# EAGLE design VF_GS_PCB (EAGLE 9.6.2)
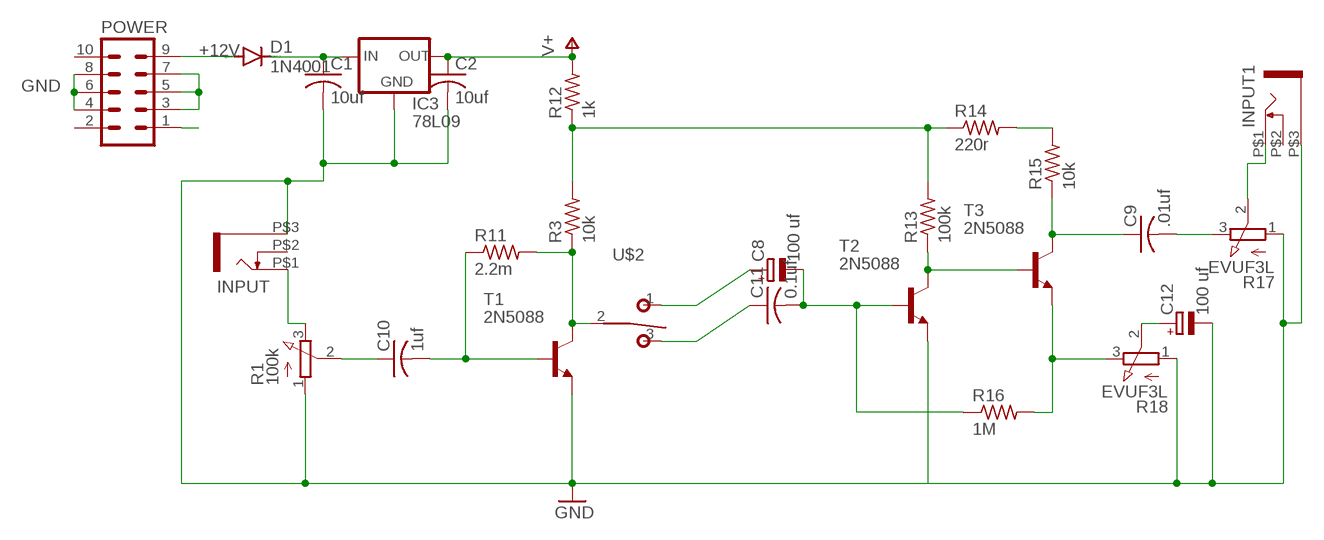
[diagram p0: schematic, sheet 1]

## Parts
C1  10uf  C-US050-025X075  [C050-025X075]
C2  10uf  C-US050-025X075  [C050-025X075]
C8  100 uf  CPOL-EUE2.5-6  [E2,5-6]
C9  .01uf  C-US050-025X075  [C050-025X075]
C10  1uf  C-US050-025X075  [C050-025X075]
C11  0.1uf  C-US050-025X075  [C050-025X075]
C12  100 uf  CPOL-EUE2.5-6  [E2,5-6]
D1  1N4001  1N4004  [DO41-10]
IC3  78L09  78LXX  [78LXX]
INPUT  WQP-PJ301M-12_JACK  [WQP-PJ301M-12_JACK]
INPUT1  WQP-PJ301M-12_JACK  [WQP-PJ301M-12_JACK]
POWER  10_PIN_HEADER  [MA05-2]
R1  100k  EVUF3L  [EVUFXL]
R3  10k  R-US_0207/7  [0207/7]
R11  2.2m  R-US_0207/7  [0207/7]
R12  1k  R-US_0207/7  [0207/7]
R13  100k  R-US_0207/7  [0207/7]
R14  220r  R-US_0207/7  [0207/7]
R15  10k  R-US_0207/7  [0207/7]
R16  1M  R-US_0207/7  [0207/7]
R17  EVUF3L  [EVUFXL]
R18  EVUF3L  [EVUFXL]
T1  2N5088  [TO92]
T2  2N5088  [TO92]
T3  2N5088  [TO92]
U$2  T-80-T-SPDT-ON-OFF-ON  [M9040P]

## Nets
+12V [power]: C1.1 D1.C IC3.IN
-12V [power]: POWER.1
GND: C1.2 C2.2 C12.- IC3.GND INPUT1.P$3 INPUT.P$3 POWER.3 POWER.4 POWER.5 POWER.6 POWER.7 POWER.8 R1.1(A) R17.1(A) R18.1(A) T1.3(E) T2.3(E)
N$1: C10.1 R1.2(S)
N$2: INPUT.P$1 R1.3(E)
N$3: INPUT1.P$1 R17.2(S)
N$4: D1.A POWER.9
N$5: C10.2 R11.1 T1.2(B)
N$14: R3.1 R11.2 T1.1(C) U$2.2(P)
N$16: R3.2 R12.1 R13.2 R14.1
N$18: C8.- C11.2 R16.1 T2.2(B)
N$20: R13.1 T2.1(C) T3.2(B)
N$22: R14.2 R15.2
N$23: C9.1 R15.1 T3.1(C)
N$24: C9.2 R17.3(E)
N$25: C12.+ R18.2(S)
N$27: C11.1 U$2.3(S)
N$28: C8.+ U$2.1(O)
N$32: R16.2 R18.3(E) T3.3(E)
V+: C2.1 IC3.OUT R12.2
Unconnected: INPUT1.P$2 INPUT.P$2 POWER.2 POWER.10

## Library data of the parts
C1 C2 C9-C11 = rcl:C-US: CAPACITOR, American symbol; SPICEPREFIX: C
C8 C12 = rcl:CPOL-EU: POLARIZED CAPACITOR, European symbol
D1 = diode:1N4004: DIODE general purpose rectifier, 1 A
IC3 = v-reg:78LXX: VOLTAGE REGULATOR
INPUT INPUT1 = thonkiconn:WQP-PJ301M-12_JACK
POWER = TomW:10_PIN_HEADER: PIN HEADER; OC_FARNELL: unknown; OC_NEWARK: unknown
R1 R17 R18 = pot:EVU: 9 mm Square Rotary Potentiometers Source: Panasonic
R3 R11-R14 = rcl:R-US_: RESISTOR, American symbol
R15 R16 = rcl:R-US_: RESISTOR, American symbol; SPICEPREFIX: R
T1-T3 = transistor:2N5088: NPN TRANSISTOR
U$2 = MusicThingModular:T-80-T-SPDT-ON-OFF-ON

## Net classes
1 power: width 0.61 mm

## Board
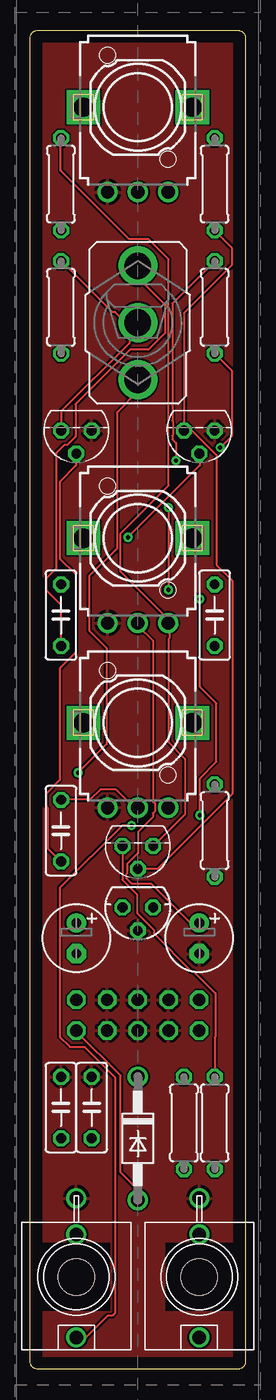
[diagram p1: board, top side]
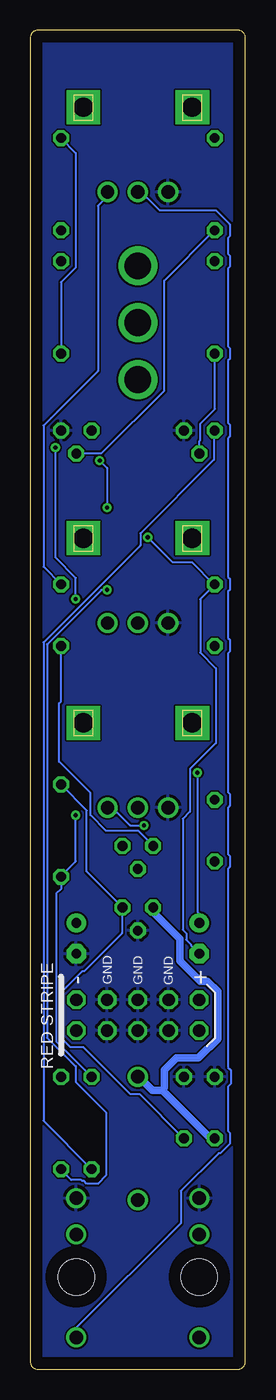
[diagram p2: board, bottom side, seen from below]

Size 17.78 x 110.49 mm. Coordinates in mm from the lower left corner, seen from the top.
Copper layers (1*16): Top 0.035mm / dielectric 1.5mm / Bottom 0.035mm
Design rules "default": minimum track width 6mil, minimum drill 0.35mm, track to track 6mil, track to pad 6mil, pad to pad 6mil, via to via 6mil, smd to smd 6mil, copper to edge 40mil, drill to drill 6mil, minimum pad ring 10mil, minimum via ring 8mil, stop-mask expansion 4mil, vias tented up to drill 0mil, thermal gap 10mil
Holes 3 mm at 3.81,7.62 13.97,7.62

### Footprints (pad centres in the part's own frame; a part is rotated, then mirrored left to right if it is on the bottom)
C050-025X075 = drill 0.813 octagon: 1 -2.54,0; 2 2.54,0
E2,5-6 = drill 0.813 pad 1.6: + -1.27,0 | drill 0.813 pad 1.6 octagon: - 1.27,0
DO41-10 = drill 1.118: A 5.08,0; C -5.08,0
78LXX = drill 0.813 octagon: GND 0,1.905; IN 1.27,0; OUT -1.27,0
WQP-PJ301M-12_JACK = drill 1.1: P$1 0,5; P$2 0,-3.5; P$3 0,-6.5
MA05-2 = drill 1.016 octagon: 1 -5.08,-1.27; 2 -5.08,1.27; 3 -2.54,-1.27; 4 -2.54,1.27; 5 0,-1.27; 6 0,1.27; 7 2.54,-1.27; 8 2.54,1.27; 9 5.08,-1.27; 10 5.08,1.27
EVUFXL = drill 1.1 pad 1.676: 1 -2.5,-7; 2 0,-7; 3 2.5,-7 | drill 1.6 pad 2.8 square: M1 4.5,0; M2 -4.5,0
0207/7 = drill 0.813 octagon: 1 -3.81,0; 2 3.81,0
TO92 = drill 0.813 octagon: 1 1.27,0; 2 0,1.905; 3 -1.27,0
M9040P = drill 2.2: 1 0,4.699 | drill 2.2 pad 3: 2 0,0; 3 0,-4.699

### Placement (x,y rotation side)
C1  2.54,21.59 90 top
C2  5.08,21.59 90 top
C8  3.81,35.56 270 top
C9  15.24,62.23 90 top
C10  2.54,44.45 270 top
C11  2.54,62.23 90 top
C12  13.97,35.56 270 top
D1  8.89,19.05 270 top
IC3  8.89,38.1 180 top
INPUT  3.81,7.62 180 top
INPUT1  13.97,7.62 180 top
POWER  8.89,29.21 0 bottom
R1  8.89,53.34 0 top
R3  12.7,20.32 90 top
R11  2.54,87.63 90 top
R12  15.24,44.45 90 top
R13  15.24,97.79 90 top
R14  15.24,87.63 90 top
R15  15.24,20.32 270 top
R16  2.54,97.79 90 top
R17  8.89,104.14 0 top
R18  8.89,68.58 0 top
T1  3.81,77.47 180 top
T2  13.97,77.47 180 top
T3  8.89,43.18 180 top
U$1  [EURO_PCB_4HP]  -1.27,-8.89 0 top  (outside the outline)
U$2  8.89,86.36 180 top

### Tracks (layer width: path | path; a pad name or v marks a point on that pad's centre or on a via)
+12V
  Bottom 0.61: C1.1 2.9,19.05 6.86,23.01 | 6.86,23.01 7.7,23.01 8.84,24.16 D1.C | IC3.IN 7.62,37.72 5.41,35.51 5.41,33.68 3.73,32 3.12,32 2.29,31.17 2.29,27.28 3.89,25.68 5.71,25.68 6.71,24.69 6.71,23.24 6.86,23.01
GND
  pour Top: -1.27,0 19.05,0 19.05,110.49 17.78,111.76 -1.27,111.76
  pour Bottom: -1.27,0 19.05,0 19.05,111.76 -1.27,111.76
N$1
  Top 0.152: C10.1 2.59,47.02 4.95,47.02 5.79,47.85 7.09,47.85 8.53,46.41 8.84,46.41 R1.2
N$2  (via drill 0.35)
  Top 0.152: v8.38,44.88 7.62,44.88 2.44,39.7 2.44,27.43 3.28,26.59 4.5,26.59 7.01,24.08 7.01,4.65 6.78,4.42 6.4,4.42 4.65,2.67 3.81,2.67 INPUT.P$1
  Bottom 0.152: v8.38,44.88 9.53,44.88 10.97,46.33 11.35,46.33 R1.3
N$3
  Bottom 0.152: INPUT1.P$1 13.97,3.4 5.33,12.04 5.33,14.71 2.21,17.83 2.06,17.83 1.29,18.59 1.29,19.51 1.45,19.66 1.45,23.32 1.22,23.55 1.22,24.69 1.45,24.92 1.45,41.3 1.29,41.45 1.29,42.37 1.45,42.52 1.45,46.33 1.29,46.48 1.29,47.47 1.45,47.62 1.45,59.05 1.29,59.21 1.29,60.2 1.45,60.35 1.45,64.16 1.29,64.31 1.29,65.23 1.45,65.38 1.45,76.81 1.29,76.96 1.29,77.95 1.45,78.11 1.45,83.21 1.29,83.36 1.29,84.28 1.45,84.43 1.45,90.83 1.29,90.98 1.29,91.9 1.45,92.05 1.45,93.34 1.29,93.5 1.29,94.49 2.44,95.63 7.09,95.63 8.53,97.08 8.84,97.08 R17.2
N$4
  Top 0.152: POWER.9 3.81,27.89 7.47,24.23 7.47,16.23 8.91,14.78 8.91,14.02 D1.A
N$5
  Top 0.152: T1.2 3.81,74.6 2.44,73.23 2.44,66.9 3.73,65.61 3.73,59.13 2.44,57.84 2.44,48.62 1.29,47.47 1.29,46.48 1.45,46.33 1.45,42.98 2.52,41.91 C10.2
  Bottom 0.152: T1.2 3.81,76.58 3.73,76.66 3.73,78.03 2.52,79.25 2.52,83.82 R11.1
N$14
  Top 0.152: 8.23,86.41 8.84,86.41 U$2.2 8.23,86.41 | 8.23,86.41 7.85,86.41 7.01,87.25 6.78,87.25 2.59,91.44 R11.2 | 8.23,86.41 8.23,84.73 2.59,79.1 2.59,77.5 T1.1
  Bottom 0.152: R3.1 16.69,20.5 16.69,59.97 8.69,67.97 8.69,68.96 2.59,75.06 2.59,77.42 T1.1
N$16  (via drill 0.35)
  Top 0.152: R14.1 16.69,82.37 16.69,77.04 v15.7,76.05 | v14.02,63.55 14.02,56.31 15.39,54.94 15.39,50.14 14.02,48.77 v14.02,45.72
  Bottom 0.152: R14.1 15.24,89.69 14.02,90.91 14.02,100.36 15.24,101.58 R13.2 | R3.2 15.62,27.05 15.62,39.24 15.24,39.62 R12.1 15.24,40.69 14.02,41.91 v14.02,45.72 | v15.7,76.05 15.7,66.98 14.02,65.3 v14.02,63.55
N$18  (via drill 0.35)
  Top 0.152: v8.08,68.66 14.02,74.6 14.02,75.51 T2.2
  Bottom 0.152: v8.08,68.66 6.02,66.6 4.42,66.6 2.59,64.77 C11.2 2.52,64.77 3.73,63.55 3.73,59.13 2.44,57.84 2.44,51.66 4.57,49.53 4.57,46.02 5.18,45.41 5.18,36.27 4.88,35.97 4.88,35.43 4.5,35.05 4.5,34.98 C8.- | R16.1 2.59,93.95 6.71,89.84 6.71,80.77 11.89,75.59 13.95,75.59 T2.2
N$20
  Top 0.152: 12.72,77.5 13.34,77.5 15.39,75.44 15.39,66.37 16.69,65.08 16.69,47.47 10.52,41.3 8.91,41.3 T3.2 | 12.72,77.5 12.72,87.17 16.69,91.14 16.69,92.51 15.24,93.95 R13.1 | 12.72,77.5 T2.1
N$22  (via drill 0.35)
  Top 0.152: v11.43,71.09 v11.43,64.31 | v12.04,74.98 12.04,76.43 11.73,76.73 11.73,77.04 11.81,77.11 11.81,78.18 11.73,78.26 11.73,87.94 R14.2
  Bottom 0.152: v11.43,64.31 11.89,64.31 16.38,59.82 16.38,27.36 14.02,24.99 14.02,23.7 11.51,21.18 11.51,16 12.19,15.32 13.11,15.32 13.34,15.54 13.49,15.54 13.56,15.62 14.4,15.62 15.24,16.46 R15.2 | v11.43,71.09 11.43,74.37 v12.04,74.98
N$23
  Top 0.152: R15.1 15.24,27.36 15.32,27.43 15.32,31.01 13.49,32.84 13.34,32.84 10.21,35.97 10.21,36.27 8.84,37.64 8.84,39.17 7.62,40.39 T3.1
  Bottom 0.152: C9.1 15.24,55.09 15.39,54.94 15.39,50.14 12.8,47.55 12.8,45.72 11.51,44.42 8.84,44.42 7.62,43.2 T3.1
N$24
  Bottom 0.152: C9.2 16.69,66.22 16.69,77.88 12.19,82.37 12.19,96.01 11.43,96.77 11.43,97.08 R17.3
N$25
  Top 0.152: C12.+ 13.95,36.88 13.18,36.88 9.98,40.08 8.38,40.08 7.92,40.54 7.92,40.84 8,40.92 8,41.68 8.91,42.6 8.91,44.35 10.13,45.57 10.13,45.87 10.29,46.02 10.29,46.71 10.13,46.86 10.13,60.12 8.91,61.34 8.91,61.57 R18.2
N$27
  Top 0.152: C11.1 2.52,59.74 2.52,63.09 1.29,64.31 1.29,65.23 2.13,66.06 2.13,75.59 2.82,76.28 3.05,76.28 3.73,76.96 3.73,79.63 8.23,84.12 9.75,84.12 11.12,85.5 11.12,87.86 8.91,90.07 8.91,91.06 U$2.3
N$28  (via drill 0.35)
  Top 0.152: v3.96,49.23 6.33,51.59 6.33,59.51 4.88,60.96 4.88,65.46 7.16,67.74 7.16,78.94 8.84,80.62 8.84,81.61 U$2.1
  Bottom 0.152: C8.+ 3.81,37.57 3.96,37.72 v3.96,49.23
N$32
  Top 0.152: T3.3 10.21,43.2 12.8,45.8 12.8,50.37 11.43,51.74 11.43,60.27 11.51,60.35 11.51,61.49 11.43,61.57 R18.3 11.35,61.65 11.35,61.95 7.47,65.84 7.47,68.96 11.43,72.92 11.43,91.59 9.75,93.27 8.15,93.27 2.52,98.91 2.52,101.58 R16.2
V+
  Bottom 0.152: C2.1 5.11,19.05 8.76,22.71 9.53,22.71 13.41,26.59 14.48,26.59 15.32,27.43 15.32,31.01 13.49,32.84 13.34,32.84 10.21,35.97 10.21,38.1 IC3.OUT 10.13,38.1 13.11,41.07 13.11,46.1 15.24,48.23 R12.2

### Text on the board
tValues: 100ka | Volume | 2n5088 | 2n5088 | Tone | 10k | Gain | 100k | 2n5088 | 78L09 | 100uf | 100uf | 1n4001
bValues: VauxFlores | GS | Baltimore, Md. | 2013 | Ithaca, NY | 2022